# Altium project PowerAmplifierHighSlewRate.PrjPCB
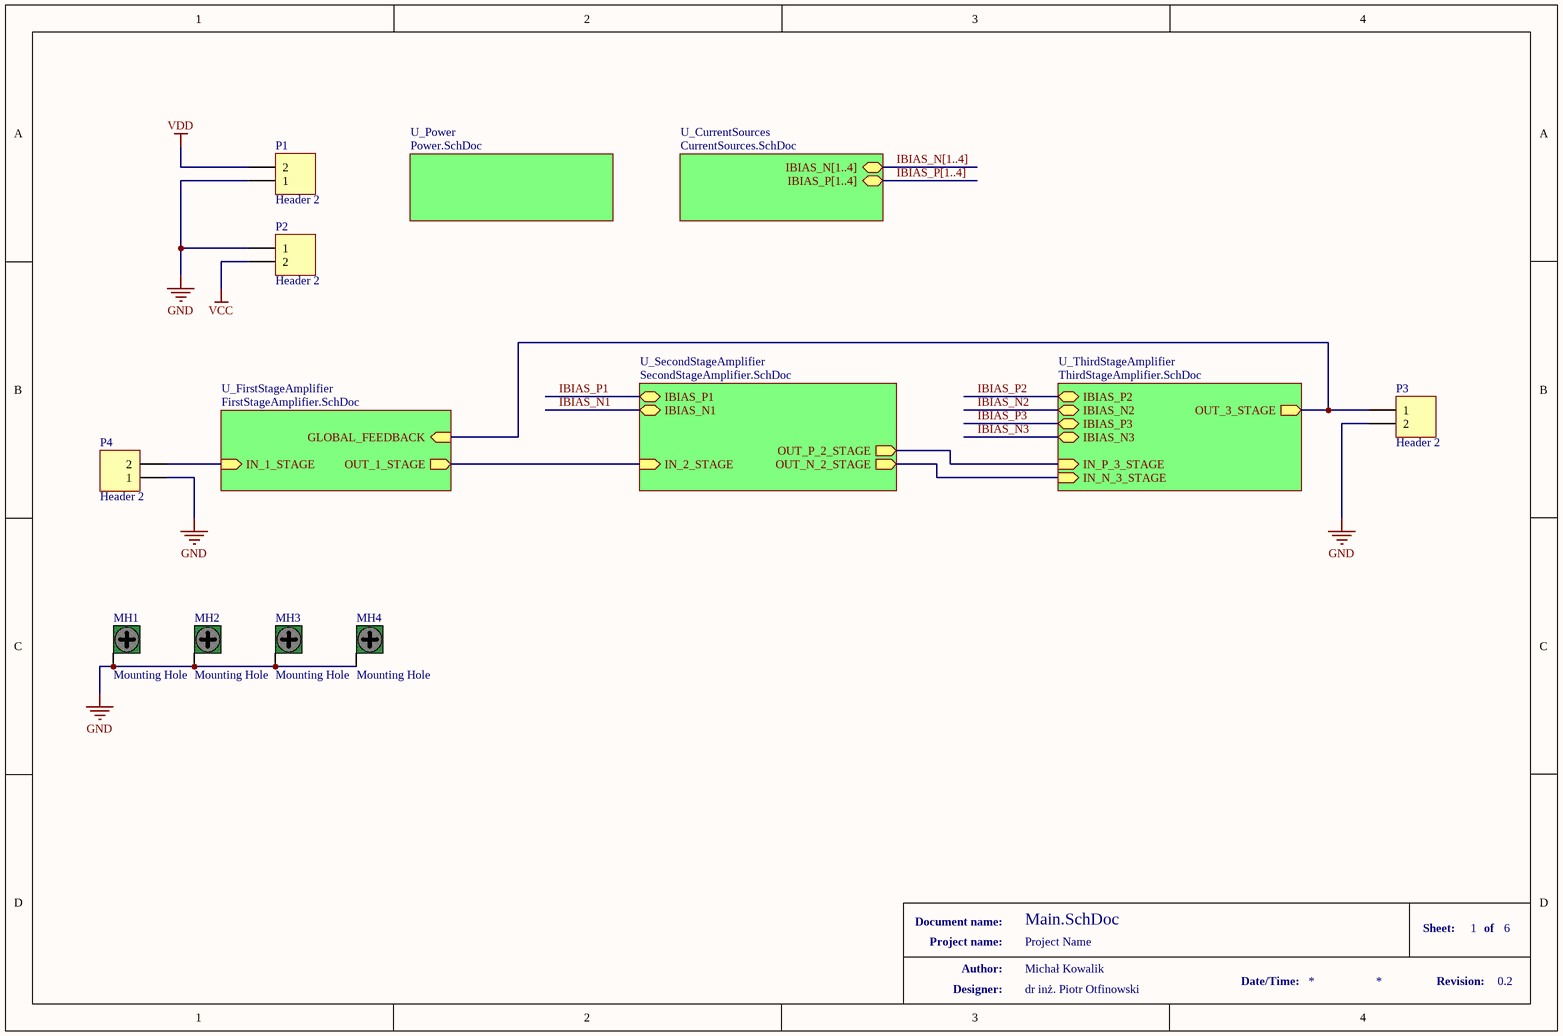
[diagram p0: Main.SchDoc]
ProjectRevision: 0.2
6 sheets, 143 parts. Net scope: hierarchical (ports join the sheet entries above them; power ports are global).
Board file: PCB.PcbDoc
Sheets:
  Main.SchDoc
    U_Power = Power.SchDoc
    U_CurrentSources = CurrentSources.SchDoc
    U_ThirdStageAmplifier = ThirdStageAmplifier.SchDoc
    U_SecondStageAmplifier = SecondStageAmplifier.SchDoc
    U_FirstStageAmplifier = FirstStageAmplifier.SchDoc

## Sheet Main.SchDoc
size A4; Author: Michał Kowalik; CompanyName: AGH; Engineer: dr inż. Piotr Otfinowski; DocumentNumber: 1; Revision: Rev; SheetNumber: 1; SheetTotal: 6; ProjectName: Project Name

### Parts
MH1  Mounting Hole  [MOUNTING HOLE 3mm]  (no BOM)
MH2  Mounting Hole  [MOUNTING HOLE 3mm]  (no BOM)
MH3  Mounting Hole  [MOUNTING HOLE 3mm]  (no BOM)
MH4  Mounting Hole  [MOUNTING HOLE 3mm]  (no BOM)
P1  Header 2  [DG300-5.0-02P-13]
P2  Header 2  [DG300-5.0-02P-13]
P3  Header 2  [DG330-5.0-02P]
P4  Header 2  [DG300-5.0-02P-13]

### Sub-sheets
U_CurrentSources = CurrentSources.SchDoc: IBIAS_N[1..4] (bidir), IBIAS_P[1..4] (bidir)
U_FirstStageAmplifier = FirstStageAmplifier.SchDoc: GLOBAL_FEEDBACK (in), IN_1_STAGE (in), OUT_1_STAGE (out)
U_Power = Power.SchDoc: no entries
U_SecondStageAmplifier = SecondStageAmplifier.SchDoc: IN_2_STAGE (in), OUT_N_2_STAGE (out), OUT_P_2_STAGE (out), IBIAS_P1 (bidir), IBIAS_N1 (bidir)
U_ThirdStageAmplifier = ThirdStageAmplifier.SchDoc: IBIAS_P2 (bidir), IBIAS_N2 (bidir), IN_N_3_STAGE (in), IN_P_3_STAGE (in), IBIAS_P3 (bidir), OUT_3_STAGE (out), IBIAS_N3 (bidir)

### Nets
GND: MH1.MOUNTING MH2.MOUNTING MH3.MOUNTING MH4.MOUNTING P1.1 P2.1 P3.2 P4.1
VCC: P2.2
VDD: P1.2
GLOBAL_FEEDBACK: P3.1 ; sheet U_ThirdStageAmplifier/OUT_3_STAGE, sheet U_FirstStageAmplifier/GLOBAL_FEEDBACK
IN_1_STAGE: P4.2 ; sheet U_FirstStageAmplifier/IN_1_STAGE
IN_2_STAGE: sheet U_SecondStageAmplifier/IN_2_STAGE, sheet U_FirstStageAmplifier/OUT_1_STAGE
IN_N_3_STAGE: sheet U_ThirdStageAmplifier/IN_N_3_STAGE, sheet U_SecondStageAmplifier/OUT_N_2_STAGE
IN_P_3_STAGE: sheet U_ThirdStageAmplifier/IN_P_3_STAGE, sheet U_SecondStageAmplifier/OUT_P_2_STAGE

### Buses and harness runs
bus IBIAS_N[1..4] = sheet U_CurrentSources/IBIAS_N[1..4]
bus IBIAS_P[1..4] = sheet U_CurrentSources/IBIAS_P[1..4]

### Notes on the sheet
- Document name:
- Project name:
- Author:
- Date/Time:
- Sheet:
- Revision:
- of
- Designer:

### Library data of the parts
P1-P4 = Header 2: Header, 2-Pin; LatestRevisionDate: 17-Jul-2002; LatestRevisionNote: Re-released for DXP Platform.; Publisher: Altium Limited

## Sheet Power.SchDoc
size A4; Author: Michał Kowalik; CompanyName: AGH; Engineer: dr inż. Piotr Otfinowski; DocumentNumber: 3; Revision: Rev; SheetNumber: 3; SheetTotal: 6; ProjectName: Project Name
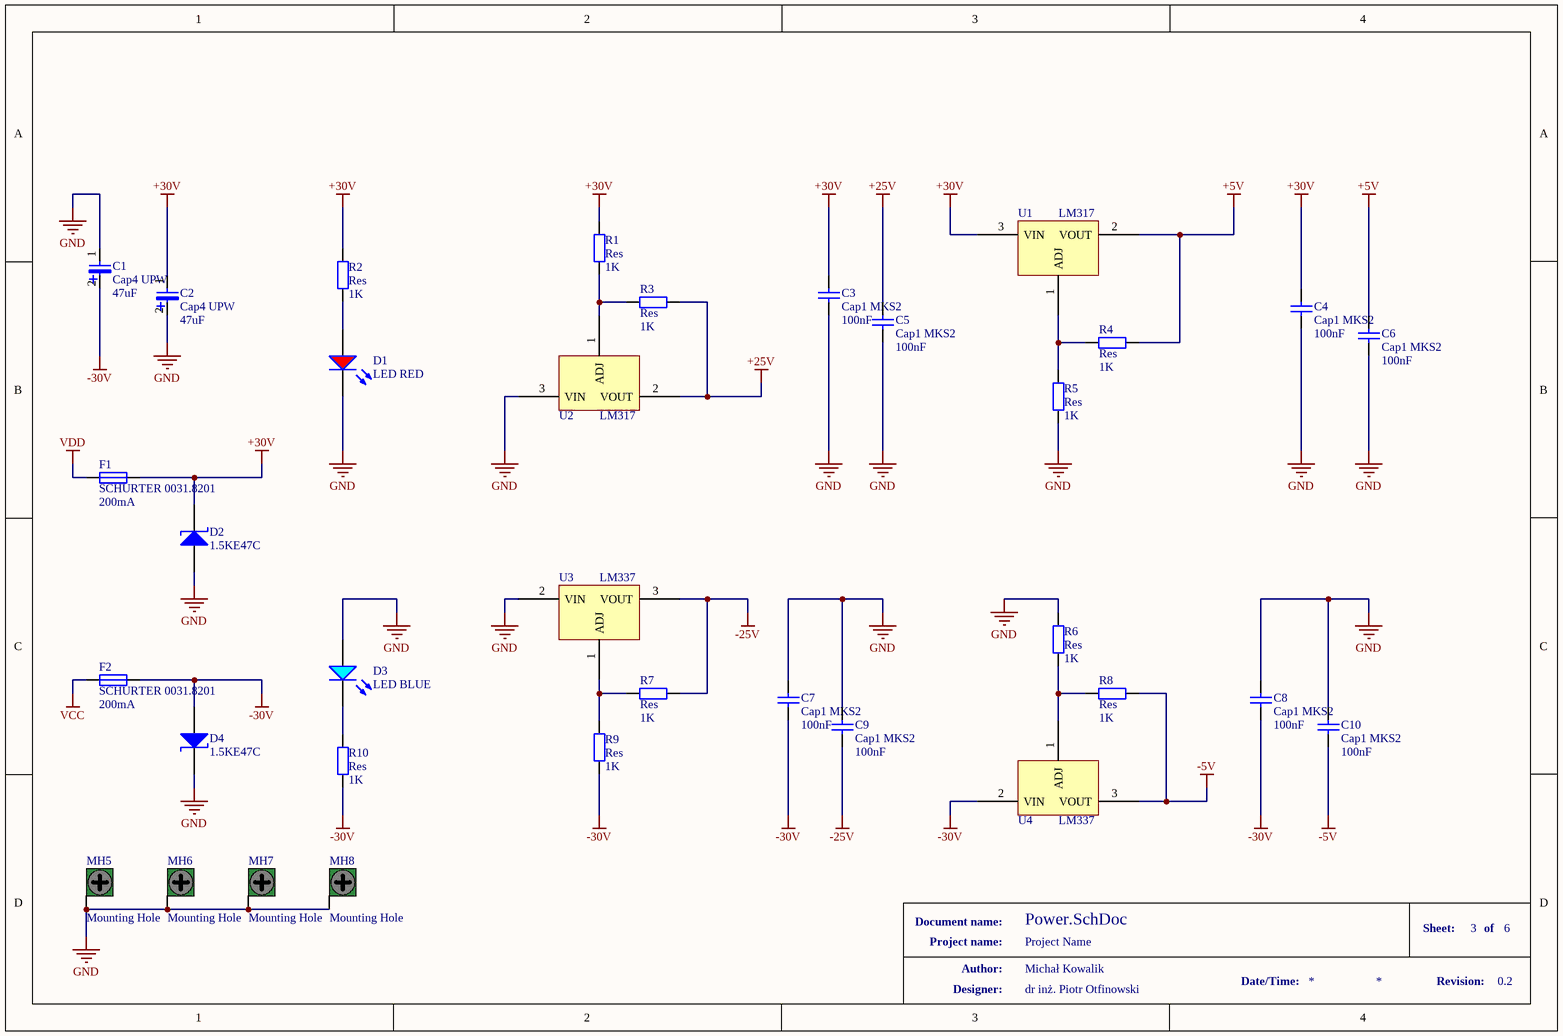
[diagram p1: Power.SchDoc]

### Parts
C1  Cap4 UPW  value 47uF  [CAP-POLARISED-2MM]
C2  Cap4 UPW  value 47uF  [CAP-POLARISED-2MM]
C3  Cap1 MKS2  value 100nF  [CAP-0.5-WIMA_MKS2]
C4  Cap1 MKS2  value 100nF  [CAP-0.5-WIMA_MKS2]
C5  Cap1 MKS2  value 100nF  [CAP-0.5-WIMA_MKS2]
C6  Cap1 MKS2  value 100nF  [CAP-0.5-WIMA_MKS2]
C7  Cap1 MKS2  value 100nF  [CAP-0.5-WIMA_MKS2]
C8  Cap1 MKS2  value 100nF  [CAP-0.5-WIMA_MKS2]
C9  Cap1 MKS2  value 100nF  [CAP-0.5-WIMA_MKS2]
C10  Cap1 MKS2  value 100nF  [CAP-0.5-WIMA_MKS2]
D1  LED RED  [DIO_0805_IPC_MD]
D2  1.5KE47C  [DIODE-0.7]
D3  LED BLUE  [DIO_0805_IPC_MD]
D4  1.5KE47C  [DIODE-0.7]
F1  SCHURTER 0031.8201  value 200mA  [SCHURTER 0031.8201]
F2  SCHURTER 0031.8201  value 200mA  [SCHURTER 0031.8201]
MH5  Mounting Hole  [MOUNTING HOLE 3mm]  (no BOM)
MH6  Mounting Hole  [MOUNTING HOLE 3mm]  (no BOM)
MH7  Mounting Hole  [MOUNTING HOLE 3mm]  (no BOM)
MH8  Mounting Hole  [MOUNTING HOLE 3mm]  (no BOM)
R1  Res  value 1K  [RESISTOR-10mm]
R2  Res  value 1K  [RESISTOR-10mm]
R3  Res  value 1K  [RESISTOR-10mm]
R4  Res  value 1K  [RESISTOR-10mm]
R5  Res  value 1K  [RESISTOR-10mm]
R6  Res  value 1K  [RESISTOR-10mm]
R7  Res  value 1K  [RESISTOR-10mm]
R8  Res  value 1K  [RESISTOR-10mm]
R9  Res  value 1K  [RESISTOR-10mm]
R10  Res  value 1K  [RESISTOR-10mm]
U1  LM317  [TO-220]
U2  LM317  [TO-220]
U3  LM337  [TO-220]
U4  LM337  [TO-220]

### Nets
+5V: C6.2 R4.1 U1.2(VOUT)
+25V: C5.2 R3.1 U2.2(VOUT)
+30V: C2.1 C3.2 C4.2 D2.2(IN2) F1.2 R1.2 R2.2 U1.3(VIN)
-5V: C10.1 R8.1 U4.3(VOUT)
-25V: C9.1 R7.1 U3.3(VOUT)
-30V: C1.2 C7.1 C8.1 D4.1(IN1) F2.2 R9.1 R10.2 U4.2(VIN)
GND: C1.1 C2.2 C3.1 C4.1 C5.1 C6.1 C7.2 C8.2 C9.2 C10.2 D1.2(K) D2.1(IN1) D3.1(A) D4.2(IN2) MH5.MOUNTING MH6.MOUNTING MH7.MOUNTING MH8.MOUNTING R5.1 R6.1 U2.3(VIN) U3.2(VIN)
VCC: F2.1
VDD: F1.1
NetD1_1: D1.1(A) R2.1
NetD3_2: D3.2(K) R10.1
NetR1_1: R1.1 R3.2 U2.1(ADJ)
NetR4_2: R4.2 R5.2 U1.1(ADJ)
NetR6_2: R6.2 R8.2 U4.1(ADJ)
NetR7_2: R7.2 R9.2 U3.1(ADJ)

### Notes on the sheet
- Document name:
- Project name:
- Author:
- Date/Time:
- Sheet:
- Revision:
- of
- Designer:

### Library data of the parts
C1 C2 = Cap4: Nichicon UPW Aluminium Electrolytic Capacitor
C3-C10 = Cap1: WIMA MKS2 Metallized Polyester (PET) / Capacitors in PCM 5 mm
D1 = LED RED: Standard SMD 0805 Red LED; Published: 8-Jun-2000; LatestRevisionDate: 08-Jul-2005; LatestRevisionNote: Mech Layer 1 removed.; PackageReference: LED-1; Publisher: Altium Limited; PackageDescription: LED; 2 Leads
D2 D4 = 1.5KE47C: Transient Voltage Suppressor Diodes; Breakdown V: 44.7...49.4, Stand-off V: 40.2
D3 = LED BLUE: Standard SMD 0805 Blue LED; Published: 8-Jun-2000; LatestRevisionDate: 08-Jul-2005; LatestRevisionNote: Mech Layer 1 removed.; PackageReference: LED-1; Publisher: Altium Limited; PackageDescription: LED; 2 Leads
F1 F2 = Fuse: Fuseholder Open Design, 5 x 20 mm, THT, SCHURTER 0031.8201
R1-R10 = Res: Resistor
U1 U2 = LM317: Wide Temperature Three-Pin Positive Adjustable Regulator
U3 U4 = LM337: Wide Temperature Three-Pin Negative Adjustable Regulator

## Sheet CurrentSources.SchDoc
size A4; CarNumber: 5; Author: Michał Kowalik; CompanyName: AGH; Engineer: dr inż. Piotr Otfinowski; DocumentNumber: 2; Revision: Rev; SheetNumber: 2; SheetTotal: 6; ProjectName: Project Name
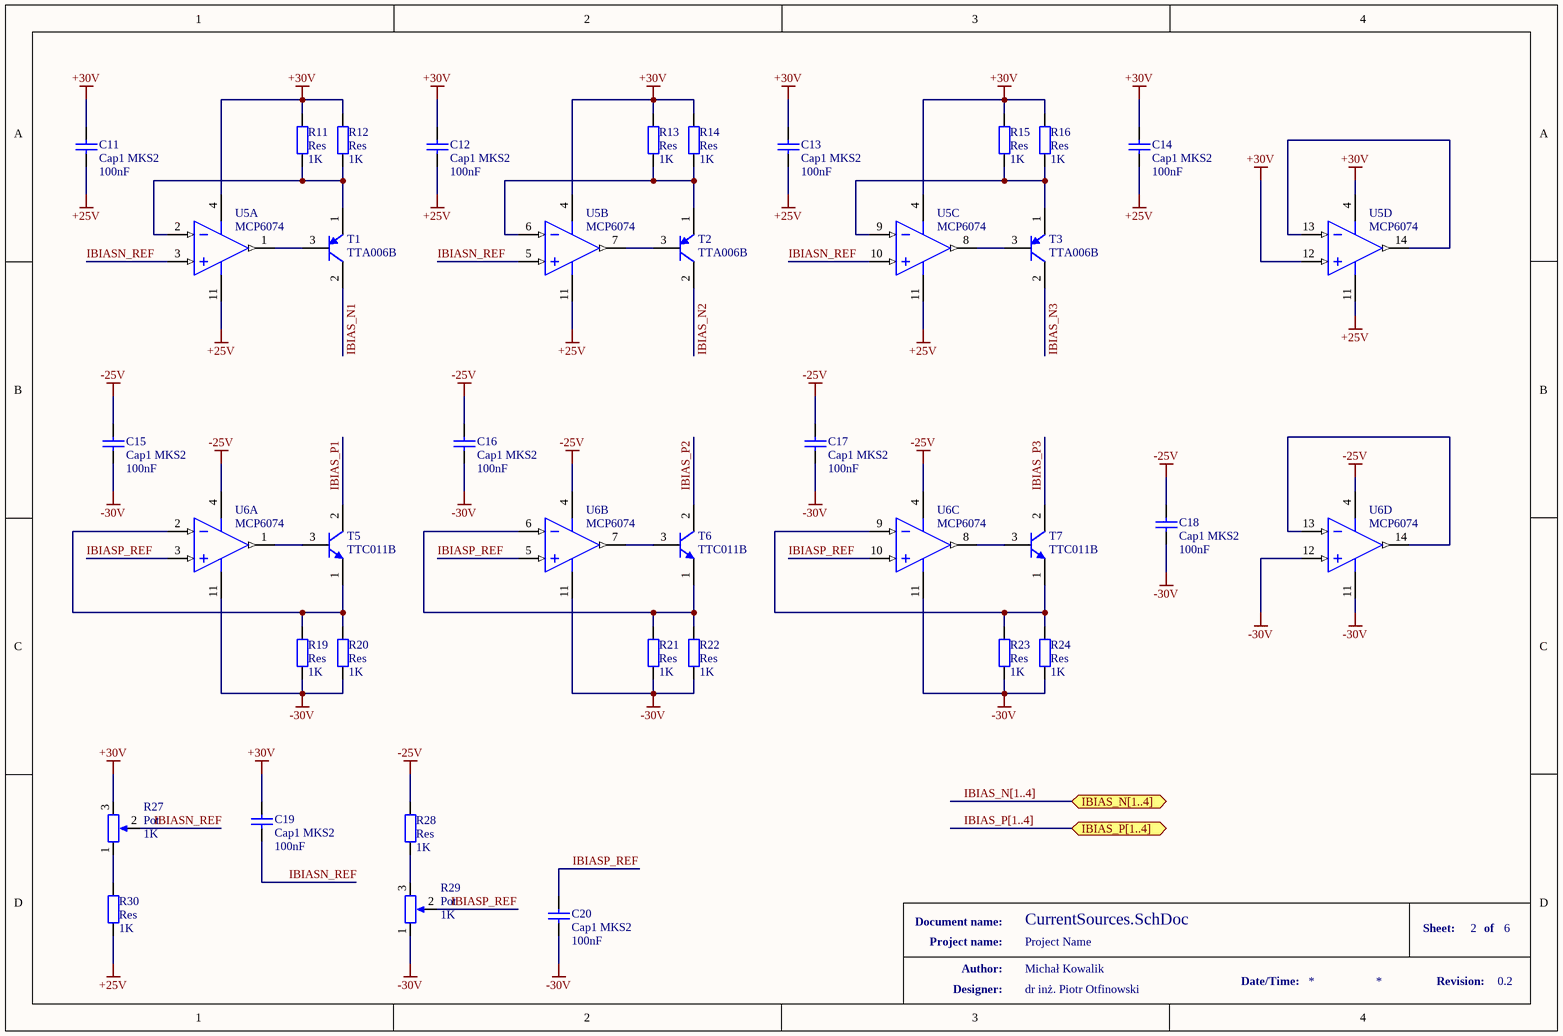
[diagram p2: CurrentSources.SchDoc]

### Parts
C11  Cap1 MKS2  value 100nF  [CAP-0.5-WIMA_MKS2]
C12  Cap1 MKS2  value 100nF  [CAP-0.5-WIMA_MKS2]
C13  Cap1 MKS2  value 100nF  [CAP-0.5-WIMA_MKS2]
C14  Cap1 MKS2  value 100nF  [CAP-0.5-WIMA_MKS2]
C15  Cap1 MKS2  value 100nF  [CAP-0.5-WIMA_MKS2]
C16  Cap1 MKS2  value 100nF  [CAP-0.5-WIMA_MKS2]
C17  Cap1 MKS2  value 100nF  [CAP-0.5-WIMA_MKS2]
C18  Cap1 MKS2  value 100nF  [CAP-0.5-WIMA_MKS2]
C19  Cap1 MKS2  value 100nF  [CAP-0.5-WIMA_MKS2]
C20  Cap1 MKS2  value 100nF  [CAP-0.5-WIMA_MKS2]
R11  Res  value 1K  [RESISTOR-10mm]
R12  Res  value 1K  [RESISTOR-10mm]
R13  Res  value 1K  [RESISTOR-10mm]
R14  Res  value 1K  [RESISTOR-10mm]
R15  Res  value 1K  [RESISTOR-10mm]
R16  Res  value 1K  [RESISTOR-10mm]
R19  Res  value 1K  [RESISTOR-10mm]
R20  Res  value 1K  [RESISTOR-10mm]
R21  Res  value 1K  [RESISTOR-10mm]
R22  Res  value 1K  [RESISTOR-10mm]
R23  Res  value 1K  [RESISTOR-10mm]
R24  Res  value 1K  [RESISTOR-10mm]
R27  Pot  value 1K  [T910W]
R28  Res  value 1K  [RESISTOR-10mm]
R29  Pot  value 1K  [T910W]
R30  Res  value 1K  [RESISTOR-10mm]
T1  TTA006B  [TO-126]
T2  TTA006B  [TO-126]
T3  TTA006B  [TO-126]
T5  TTC011B  [TO-126]
T6  TTC011B  [TO-126]
T7  TTC011B  [TO-126]
U5  MCP6074  [SO_14_IPC_MD]  (parts A,B,C,D of 4)
U6  MCP6074  [SO_14_IPC_MD]  (parts A,B,C,D of 4)

### Ports
IBIAS_N[1..4] (bidir), IBIAS_P[1..4] (bidir)

### Nets
+25V: C11.1 C12.1 C13.1 C14.1 R30.1 U5.11(VSS)
+30V: C11.2 C12.2 C13.2 C14.2 C19.2 R11.2 R12.2 R13.2 R14.2 R15.2 R16.2 R27.3 U5.4(VDD) U5.12(VIND+)
-25V: C15.2 C16.2 C17.2 C18.2 R28.2 U6.4(VDD)
-30V: C15.1 C16.1 C17.1 C18.1 C20.1 R19.1 R20.1 R21.1 R22.1 R23.1 R24.1 R29.1 U6.11(VSS) U6.12(VIND+)
IBIAS_N1: T1.2(C)
IBIAS_N2: T2.2(C)
IBIAS_N3: T3.2(C)
IBIAS_P1: T5.2(C)
IBIAS_P2: T6.2(C)
IBIAS_P3: T7.2(C)
IBIASN_REF: C19.1 R27.2 U5.3(VINA+) U5.5(VINB+) U5.10(VINC+)
IBIASP_REF: C20.2 R29.2 U6.3(VINA+) U6.5(VINB+) U6.10(VINC+)
NetR11_1: R11.1 R12.1 T1.1(E) U5.2(VINA-)
NetR13_1: R13.1 R14.1 T2.1(E) U5.6(VINB-)
NetR15_1: R15.1 R16.1 T3.1(E) U5.9(VINC-)
NetR19_2: R19.2 R20.2 T5.1(E) U6.2(VINA-)
NetR21_2: R21.2 R22.2 T6.1(E) U6.6(VINB-)
NetR23_2: R23.2 R24.2 T7.1(E) U6.9(VINC-)
NetR27_1: R27.1 R30.2
NetR28_1: R28.1 R29.3
NetT1_3: T1.3(B) U5.1(VOUTA)
NetT2_3: T2.3(B) U5.7(VOUTB)
NetT3_3: T3.3(B) U5.8(VOUTC)
NetT5_3: T5.3(B) U6.1(VOUTA)
NetT6_3: T6.3(B) U6.7(VOUTB)
NetT7_3: T7.3(B) U6.8(VOUTC)
NetU5_13: U5.13(VIND-) U5.14(VOUTD)
NetU6_13: U6.13(VIND-) U6.14(VOUTD)

### Buses and harness runs
bus IBIAS_N[1..4] = port IBIAS_N[1..4]
bus IBIAS_P[1..4] = port IBIAS_P[1..4]

### Notes on the sheet
- Document name:
- Project name:
- Author:
- Date/Time:
- Sheet:
- Revision:
- of
- Designer:

### Library data of the parts
C11-C20 = Cap1: as C3 on sheet Power
R11-R16 R19-R24 R28 R30 = Res: Resistor
R27 R29 = Pot: Potentiometer
T1-T3 = TTA006B: PNP High Voltage Transistor; ComponentLink1Description: Manufacturer Link; ComponentLink1URL: http://www.fairchildsemi.com/; ComponentLink2Description: Datasheet; ComponentLink2URL: http://www.fairchildsemi.com/ds/2N%2F2N3906.pdf
T5-T7 = TTC011B: NPN High Voltage Transistor; ComponentLink1Description: Manufacturer Link; ComponentLink1URL: http://www.fairchildsemi.com/; ComponentLink2Description: Datasheet; ComponentLink2URL: http://www.fairchildsemi.com/ds/2N%2F2N3904.pdf
U5 U6 = MCP6074: 110 µA, High Precision Quad Op Amp, 14-Pin SOIC, Extended Temperature, Tape and Reel; Published: 2-Dec-2009; DatasheetVersion: revA, Mar-2009; PackageVersion: revBB, Aug-2009; PackageReference: SOIC-SL14; Publisher: Altium Limited; PackageDescription: 14-Lead Plastic Small Outline (SL) - Narrow, 3.90mm Body [SOIC]; Supplier 1: Digi-Key; Supplier Part Number 1: MCP6074T-E/SL-ND; Code_JEDEC: MS-012-AB; Code_IPC: SOIC127P600-14; ComponentLink1Description: Datasheet; ComponentLink1URL: http://ww1.microchip.com/downloads/en/DeviceDoc/22142a.pdf; ComponentLink2Description: Packaging Specification; ComponentLink2URL: http://www.microchip.com/stellent/groups/techpub_sg/documents/packagingspec/en012702.pdf; ComponentLink3Description: Microchip.com Home; ComponentLink3URL: http://www.microchip.com/

## Sheet ThirdStageAmplifier.SchDoc
size A4; Author: Michał Kowalik; CompanyName: AGH; Engineer: dr inż. Piotr Otfinowski; DocumentNumber: 4; Revision: Rev; SheetNumber: 4; SheetTotal: 6; ProjectName: Project Name
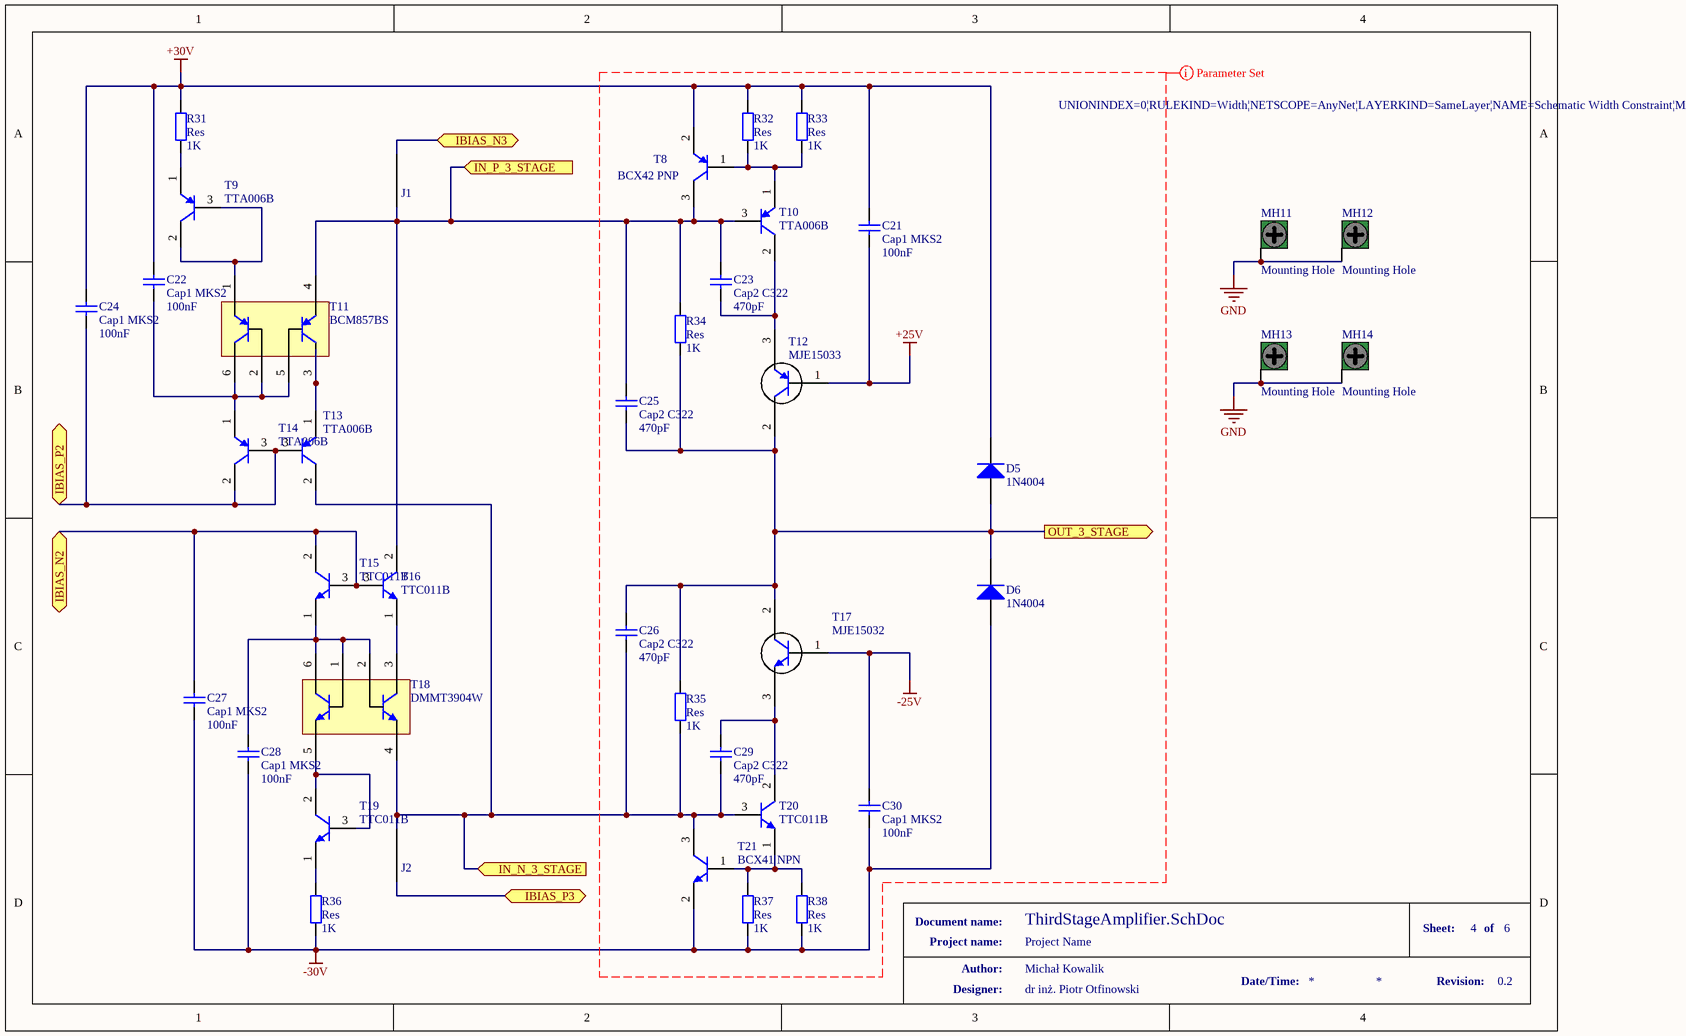
[diagram p3: ThirdStageAmplifier.SchDoc]

### Parts
C21  Cap1 MKS2  value 100nF  [CAP-0.5-WIMA_MKS2]
C22  Cap1 MKS2  value 100nF  [CAP-0.5-WIMA_MKS2]
C23  Cap2 C322  value 470pF  [CAP-CERAMIC-200MIL]
C24  Cap1 MKS2  value 100nF  [CAP-0.5-WIMA_MKS2]
C25  Cap2 C322  value 470pF  [CAP-CERAMIC-200MIL]
C26  Cap2 C322  value 470pF  [CAP-CERAMIC-200MIL]
C27  Cap1 MKS2  value 100nF  [CAP-0.5-WIMA_MKS2]
C28  Cap1 MKS2  value 100nF  [CAP-0.5-WIMA_MKS2]
C29  Cap2 C322  value 470pF  [CAP-CERAMIC-200MIL]
C30  Cap1 MKS2  value 100nF  [CAP-0.5-WIMA_MKS2]
D5  1N4004  [DO-41]
D6  1N4004  [DO-41]
J1  NetTie  [NETTIE_20mil]  (value not drawn)  (net tie, no BOM)
J2  NetTie  [NETTIE_20mil]  (value not drawn)  (net tie, no BOM)
MH11  Mounting Hole  [MOUNTING HOLE 3mm]  (no BOM)
MH12  Mounting Hole  [MOUNTING HOLE 3mm]  (no BOM)
MH13  Mounting Hole  [MOUNTING HOLE 3mm]  (no BOM)
MH14  Mounting Hole  [MOUNTING HOLE 3mm]  (no BOM)
R31  Res  value 1K  [RESISTOR-10mm]
R32  Res  value 1K  [RESISTOR-10mm]
R33  Res  value 1K  [RESISTOR-10mm]
R34  Res  value 1K  [RESISTOR-10mm]
R35  Res  value 1K  [RESISTOR-10mm]
R36  Res  value 1K  [RESISTOR-10mm]
R37  Res  value 1K  [RESISTOR-10mm]
R38  Res  value 1K  [RESISTOR-10mm]
T8  BCX42 PNP  [SOT23_IPC_MD]
T9  TTA006B  [TO-126]
T10  TTA006B  [TO-126]
T11  BCM857BS  [SOT363_IPC_MD]
T12  MJE15033  [TO-220]
T13  TTA006B  [TO-126]
T14  TTA006B  [TO-126]
T15  TTC011B  [TO-126]
T16  TTC011B  [TO-126]
T17  MJE15032  [TO-220]
T18  DMMT3904W  [SOT363_IPC_MD]
T19  TTC011B  [TO-126]
T20  TTC011B  [TO-126]
T21  BCX41 NPN  [SOT23_IPC_MD]

### Ports
IBIAS_N2 (bidir), IBIAS_N3 (bidir), IBIAS_P2 (bidir), IBIAS_P3 (bidir), IN_N_3_STAGE (in), IN_P_3_STAGE (in), OUT_3_STAGE (out)

### Nets
+25V: C21.1 T12.1(B)
+30V: C21.2 C22.2 C24.2 D5.2(IN2) R31.2 R32.2 R33.2 T8.2(E)
-25V: C30.2 T17.1(B)
-30V: C27.1 C28.1 C30.1 D6.1(IN1) R36.1 R37.1 R38.1 T21.2(E)
GND: MH11.MOUNTING MH12.MOUNTING MH13.MOUNTING MH14.MOUNTING
GLOBAL_FEEDBACK: C25.1 C26.2 D5.1(IN1) D6.2(IN2) R34.1 R35.2 T12.2(C) T17.2(C) ; port OUT_3_STAGE
IBIAS_N2: C27.2 T15.2(C) T15.3(B) T16.3(B) ; port IBIAS_N2
IBIAS_N3: J1.1 ; port IBIAS_N3
IBIAS_P2: C24.1 T13.3(B) T14.2(C) T14.3(B) ; port IBIAS_P2
IBIAS_P3: J2.1 ; port IBIAS_P3
IN_N_3_STAGE: C26.1 C29.1 J2.2 R35.1 T13.2(C) T18.4(E2) T20.3(B) T21.3(C) ; port IN_N_3_STAGE
IN_P_3_STAGE: C23.2 C25.2 J1.2 R34.2 T8.3(C) T10.3(B) T11.4(C2) T16.2(C) ; port IN_P_3_STAGE
NetC22_1: C22.1 T11.2(B1) T11.5(B2) T11.6(E1) T14.1(E)
NetC23_1: C23.1 T10.2(C) T12.3(E)
NetC28_2: C28.2 T15.1(E) T18.1(B1) T18.2(B2) T18.6(C1)
NetC29_2: C29.2 T17.3(E) T20.2(C)
NetR31_1: R31.1 T9.1(E)
NetR32_1: R32.1 R33.1 T8.1(B) T10.1(E)
NetR36_2: R36.2 T19.1(E)
NetR37_2: R37.2 R38.2 T20.1(E) T21.1(B)
NetT9_2: T9.2(C) T9.3(B) T11.1(C1)
NetT11_3: T11.3(E2) T13.1(E)
NetT16_1: T16.1(E) T18.3(C2)
NetT18_5: T18.5(E1) T19.2(C) T19.3(B)

### Layout directives
rule Width Constraint [Pref Width = 15mil    Min Width = 12mil    Max Width = 20mil]: +25V, -25V

### Notes on the sheet
- Document name:
- Project name:
- Author:
- Date/Time:
- Sheet:
- Revision:
- of
- Designer:

### Library data of the parts
C21 C22 C24 C27 C28 C30 = Cap1: as C3 on sheet Power
C23 C25 C26 C29 = Cap2: KEMEX Radial Leaded Multilayer Ceramic Capacitors / Goldmax, 300 Series, Conformally Coated, / C0G Dielectric, 25 – 250 VDC (Commercial Grade)
D5 D6 = 1N4004: Standard Recovery Rectifier Diodes
R31-R38 = Res: Resistor
T8 = BCX42: PNP Silicon AF and Switching Transistor; ComponentLink1Description: Manufacturer Link; ComponentLink1URL: http://www.fairchildsemi.com/; ComponentLink2Description: Datasheet; ComponentLink2URL: http://www.fairchildsemi.com/ds/2N%2F2N3906.pdf
T9 T10 T13 T14 = TTA006B: PNP High Voltage Transistor; ComponentLink1Description: Manufacturer Link; ComponentLink1URL: http://www.fairchildsemi.com/; ComponentLink2Description: Datasheet; ComponentLink2URL: http://www.fairchildsemi.com/ds/2N%2F2N3906.pdf
T11 = BCM857BS: 40V MATCHED PAIR NPN SMALL SIGNAL TRANSISTOR
T12 = MJE15033: PNP High Power Transistor; ComponentLink1Description: Manufacturer Link; ComponentLink1URL: http://www.fairchildsemi.com/; ComponentLink2Description: Datasheet; ComponentLink2URL: http://www.fairchildsemi.com/ds/2N%2F2N3904.pdf
T15 T16 T19 T20 = TTC011B: NPN High Voltage Transistor; ComponentLink1Description: Manufacturer Link; ComponentLink1URL: http://www.fairchildsemi.com/; ComponentLink2Description: Datasheet; ComponentLink2URL: http://www.fairchildsemi.com/ds/2N%2F2N3904.pdf
T17 = MJE15032: NPN High Power Transistor; ComponentLink1Description: Manufacturer Link; ComponentLink1URL: http://www.fairchildsemi.com/; ComponentLink2Description: Datasheet; ComponentLink2URL: http://www.fairchildsemi.com/ds/2N%2F2N3904.pdf
T18 = DMMT3904W: 40V MATCHED PAIR NPN SMALL SIGNAL TRANSISTOR
T21 = BCX41: NPN Silicon AF and Switching Transistor; ComponentLink1Description: Manufacturer Link; ComponentLink1URL: http://www.fairchildsemi.com/; ComponentLink2Description: Datasheet; ComponentLink2URL: http://www.fairchildsemi.com/ds/2N%2F2N3904.pdf

## Sheet SecondStageAmplifier.SchDoc
size A4; Author: Michał Kowalik; CompanyName: AGH; Engineer: dr inż. Piotr Otfinowski; DocumentNumber: 5; Revision: Rev; SheetNumber: 5; SheetTotal: 6; ProjectName: Project Name
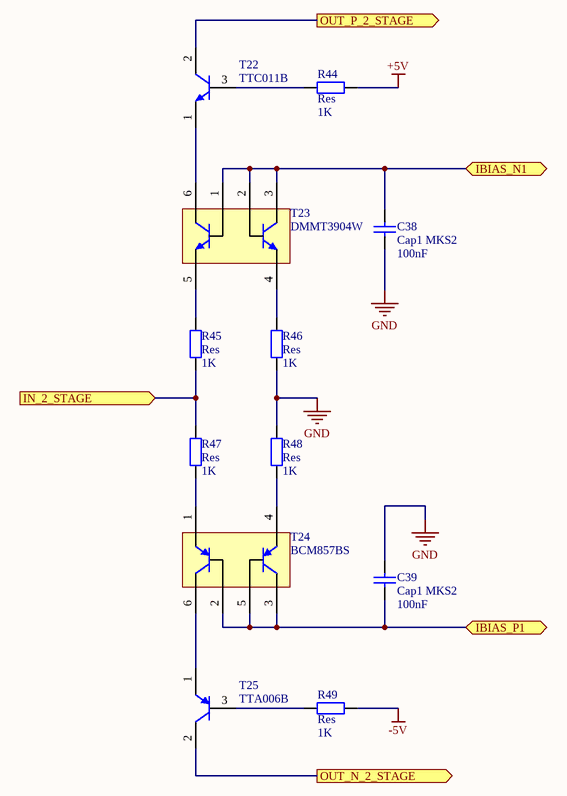
[diagram p4: SecondStageAmplifier.SchDoc]

### Parts
C38  Cap1 MKS2  value 100nF  [CAP-0.5-WIMA_MKS2]
C39  Cap1 MKS2  value 100nF  [CAP-0.5-WIMA_MKS2]
R44  Res  value 1K  [RESISTOR-10mm]
R45  Res  value 1K  [RESISTOR-10mm]
R46  Res  value 1K  [RESISTOR-10mm]
R47  Res  value 1K  [RESISTOR-10mm]
R48  Res  value 1K  [RESISTOR-10mm]
R49  Res  value 1K  [RESISTOR-10mm]
T22  TTC011B  [TO-126]
T23  DMMT3904W  [SOT363_IPC_MD]
T24  BCM857BS  [SOT363_IPC_MD]
T25  TTA006B  [TO-126]

### Ports
IBIAS_N1 (bidir), IBIAS_P1 (bidir), IN_2_STAGE (in), OUT_N_2_STAGE (out), OUT_P_2_STAGE (out)

### Nets
+5V: R44.2
-5V: R49.2
GND: C38.1 C39.2 R46.1 R48.2
IBIAS_N1: C38.2 T23.1(B1) T23.2(B2) T23.3(C2) ; port IBIAS_N1
IBIAS_P1: C39.1 T24.2(B1) T24.3(E2) T24.5(B2) ; port IBIAS_P1
IN_2_STAGE: R45.1 R47.2 ; port IN_2_STAGE
IN_N_3_STAGE: T25.2(C) ; port OUT_N_2_STAGE
IN_P_3_STAGE: T22.2(C) ; port OUT_P_2_STAGE
NetR44_1: R44.1 T22.3(B)
NetR45_2: R45.2 T23.5(E1)
NetR46_2: R46.2 T23.4(E2)
NetR47_1: R47.1 T24.1(C1)
NetR48_1: R48.1 T24.4(C2)
NetR49_1: R49.1 T25.3(B)
NetT22_1: T22.1(E) T23.6(C1)
NetT24_6: T24.6(E1) T25.1(E)

### Notes on the sheet
- Document name:
- Project name:
- Author:
- Date/Time:
- Sheet:
- Revision:
- of
- Designer:

### Library data of the parts
C38 C39 = Cap1: as C3 on sheet Power
R44-R49 = Res: Resistor
T22 = TTC011B: NPN High Voltage Transistor; ComponentLink1Description: Manufacturer Link; ComponentLink1URL: http://www.fairchildsemi.com/; ComponentLink2Description: Datasheet; ComponentLink2URL: http://www.fairchildsemi.com/ds/2N%2F2N3904.pdf
T23 = DMMT3904W: as T18 on sheet ThirdStageAmplifier
T24 = BCM857BS: as T11 on sheet ThirdStageAmplifier
T25 = TTA006B: PNP High Voltage Transistor; ComponentLink1Description: Manufacturer Link; ComponentLink1URL: http://www.fairchildsemi.com/; ComponentLink2Description: Datasheet; ComponentLink2URL: http://www.fairchildsemi.com/ds/2N%2F2N3906.pdf

## Sheet FirstStageAmplifier.SchDoc
size A4; CarNumber: 5; Author: Michał Kowalik; CompanyName: AGH; Engineer: dr inż. Piotr Otfinowski; DocumentNumber: 6; Revision: Rev; SheetNumber: 6; SheetTotal: 6; ProjectName: Project Name
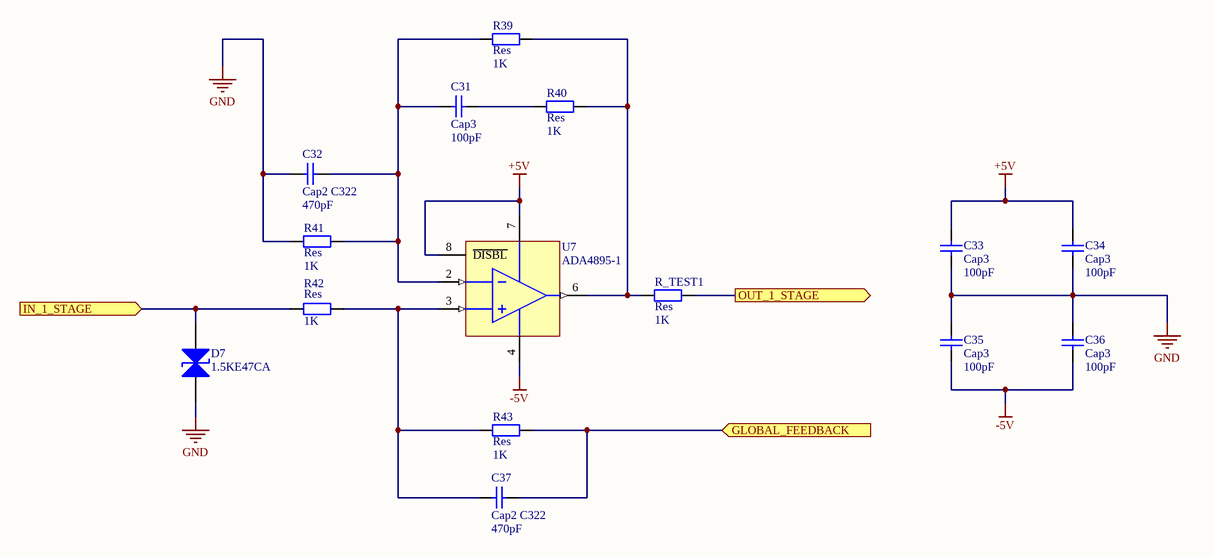
[diagram p5: FirstStageAmplifier.SchDoc]

### Parts
C31  Cap3  value 100pF  [CAP_0805_IPC_MD]
C32  Cap2 C322  value 470pF  [CAP-CERAMIC-200MIL]
C33  Cap3  value 100pF  [CAP_0805_IPC_MD]
C34  Cap3  value 100pF  [CAP_0805_IPC_MD]
C35  Cap3  value 100pF  [CAP_0805_IPC_MD]
C36  Cap3  value 100pF  [CAP_0805_IPC_MD]
C37  Cap2 C322  value 470pF  [CAP-CERAMIC-200MIL]
D7  1.5KE47CA  [DIODE-0.7]
R39  Res  value 1K  [RESISTOR-10mm]
R40  Res  value 1K  [RESISTOR-10mm]
R41  Res  value 1K  [RESISTOR-10mm]
R42  Res  value 1K  [RESISTOR-10mm]
R43  Res  value 1K  [RESISTOR-10mm]
R_TEST1  Res  value 1K  [RESISTOR-10mm]
U7  ADA4895-1  [SOIC_8_IPC_MD]

### Ports
GLOBAL_FEEDBACK (in), IN_1_STAGE (in), OUT_1_STAGE (out)

### Nets
+5V: C33.2 C34.2 U7.7(VDD) U7.8(~{DISBL})
-5V: C35.1 C36.1 U7.4(VSS)
GND: C32.1 C33.1 C34.1 C35.2 C36.2 D7.1(IN1) R41.1
GLOBAL_FEEDBACK: C37.2 R43.2 ; port GLOBAL_FEEDBACK
IN_1_STAGE: D7.2(IN2) R42.1 ; port IN_1_STAGE
IN_2_STAGE: R_TEST1.2 ; port OUT_1_STAGE
NetC31_1: C31.1 C32.2 R39.1 R41.2 U7.2(VIND-)
NetC31_2: C31.2 R40.1
NetC37_1: C37.1 R42.2 R43.1 U7.3(VIND+)
NetR39_2: R39.2 R40.2 R_TEST1.1 U7.6(VOUTD)

### Notes on the sheet
- Document name:
- Project name:
- Author:
- Date/Time:
- Sheet:
- Revision:
- of
- Designer:

### Library data of the parts
C31 C33-C36 = Cap3: Standard SMD 0805 Capacitor
C32 C37 = Cap2: as C23 on sheet ThirdStageAmplifier
D7 = 1.5KE47CA: Transient Voltage Suppressor Diodes; Breakdown V: 44.7...49.4, Stand-off V: 40.2
R39-R43 R_TEST1 = Res: Resistor
U7 = ADA4895-1: Low Power, 1 nV/√Hz, G ≥ 10 Stable, Rail-to-Rail Output Amplifier

## Nets that join several sheets
+5V: Power (C6.2 R4.1 U1.2), SecondStageAmplifier (R44.2), FirstStageAmplifier (C33.2 C34.2 U7.7 U7.8)
+25V: Power (C5.2 R3.1 U2.2), CurrentSources (6 pins), ThirdStageAmplifier (C21.1 T12.1)
+30V: Power (8 pins), CurrentSources (14 pins), ThirdStageAmplifier (8 pins)
-5V: Power (C10.1 R8.1 U4.3), SecondStageAmplifier (R49.2), FirstStageAmplifier (C35.1 C36.1 U7.4)
-25V: Power (C9.1 R7.1 U3.3), CurrentSources (6 pins), ThirdStageAmplifier (C30.2 T17.1)
-30V: Power (8 pins), CurrentSources (14 pins), ThirdStageAmplifier (8 pins)
GND: Main (8 pins), Power (22 pins), ThirdStageAmplifier (MH11.MOUNTING MH12.MOUNTING MH13.MOUNTING MH14.MOUNTING), SecondStageAmplifier (C38.1 C39.2 R46.1 R48.2), FirstStageAmplifier (7 pins)
VCC: Main (P2.2), Power (F2.1)
VDD: Main (P1.2), Power (F1.1)
GLOBAL_FEEDBACK: Main (P3.1), ThirdStageAmplifier (8 pins), FirstStageAmplifier (C37.2 R43.2)
IBIAS_N1: CurrentSources (T1.2), SecondStageAmplifier (C38.2 T23.1 T23.2 T23.3)
IBIAS_N2: CurrentSources (T2.2), ThirdStageAmplifier (C27.2 T15.2 T15.3 T16.3)
IBIAS_N3: CurrentSources (T3.2), ThirdStageAmplifier (J1.1)
IBIAS_P1: CurrentSources (T5.2), SecondStageAmplifier (C39.1 T24.2 T24.3 T24.5)
IBIAS_P2: CurrentSources (T6.2), ThirdStageAmplifier (C24.1 T13.3 T14.2 T14.3)
IBIAS_P3: CurrentSources (T7.2), ThirdStageAmplifier (J2.1)
IN_1_STAGE: Main (P4.2), FirstStageAmplifier (D7.2 R42.1)
IN_2_STAGE: SecondStageAmplifier (R45.1 R47.2), FirstStageAmplifier (R_TEST1.2)
IN_N_3_STAGE: ThirdStageAmplifier (8 pins), SecondStageAmplifier (T25.2)
IN_P_3_STAGE: ThirdStageAmplifier (8 pins), SecondStageAmplifier (T22.2)